# EAGLE design diode_sampling_gate_xformer (EAGLE 9.2.2)
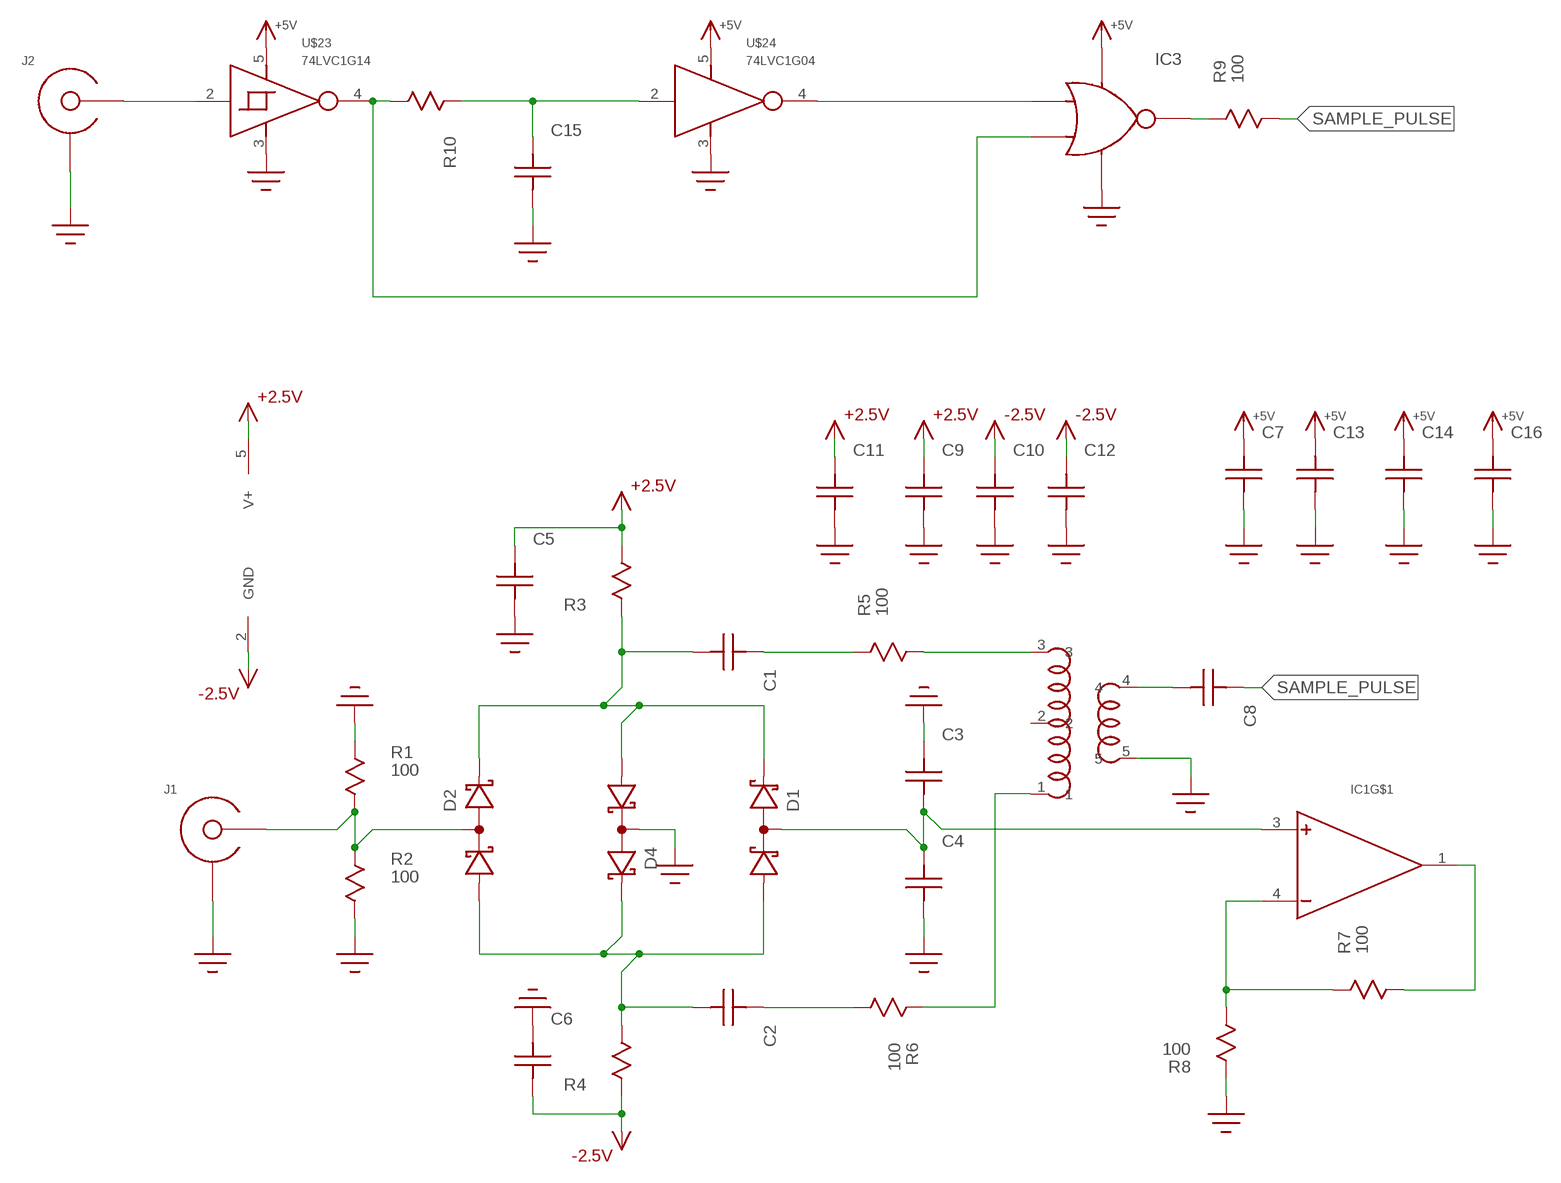
[diagram p0: schematic, sheet 1]

## Parts
C1  C0603  [C0603]
C2  C0603  [C0603]
C3  C0603  [C0603]
C4  C0603  [C0603]
C5  C0603  [C0603]
C6  C0603  [C0603]
C7  C0603  [C0603]
C8  C0603  [C0603]
C9  C0603  [C0603]
C10  C0603  [C0603]
C11  C0805  [0805]
C12  C0805  [0805]
C13  C0603  [C0603]
C14  C0603  [C0603]
C15  C0603  [C0603]
C16  C0805  [0805]
D1  BAS40-04  [SOT-23]
D2  BAS40-04  [SOT-23]
D4  BAS40-04  [SOT-23]
IC1  MCP6V81  [SOT23-5]
IC3  74LVC1G02  [SOT23-5]
J1  EDGE_LAUNCH_JACK  [EDGE_LAUNCH_RF_CON]
J2  EDGE_LAUNCH_JACK  [EDGE_LAUNCH_RF_CON]
R1  100  R0603  [R0603]
R2  100  R0603  [R0603]
R3  R0603  [R0603]
R4  R0603  [R0603]
R5  100  R0603  [R0603]
R6  100  R0603  [R0603]
R7  100  R0603  [R0603]
R8  100  R0603  [R0603]
R9  100  R0603  [R0603]
R10  R0603  [R0603]
T1  MABAES0061  [MABAES0061]
U$23  74LVC1G14  [SOT23-5]
U$24  74LVC1G04  [SOT23-5]

## Nets
+2.5V: C5.P$2 C9.P$2 C11.P$2 IC1.5(V+) R3.P$2
+5V: C7.P$2 C13.P$2 C14.P$2 C16.P$2 IC3.5(VCC) U$23.5(VCC) U$24.5(VCC)
-2.5V: C6.P$1 C10.P$2 C12.P$2 IC1.2(GND) R4.P$1
GND: C3.P$2 C4.P$1 C5.P$1 C6.P$2 C7.P$1 C9.P$1 C10.P$1 C11.P$1 C12.P$1 C13.P$1 C14.P$1 C15.P$1 C16.P$1 D4.3(COMMON) IC3.3(GND) J1.GND@1(SHIELD) J1.GND@2(SHIELD) J1.GND@3(SHIELD) J1.GND@4(SHIELD) J1.GND@5(SHIELD) J1.GND@6(SHIELD) J1.GND@7(SHIELD) J1.GND@8(SHIELD) J1.GND@9(SHIELD) J1.GND@10(SHIELD) J1.GND@11(SHIELD) J1.GND@12(SHIELD) J1.SHIELD@1(SHIELD) J1.SHIELD@2(SHIELD) J2.GND@1(SHIELD) J2.GND@2(SHIELD) J2.GND@3(SHIELD) J2.GND@4(SHIELD) J2.GND@5(SHIELD) J2.GND@6(SHIELD) J2.GND@7(SHIELD) J2.GND@8(SHIELD) J2.GND@9(SHIELD) J2.GND@10(SHIELD) J2.GND@11(SHIELD) J2.GND@12(SHIELD) J2.SHIELD@1(SHIELD) J2.SHIELD@2(SHIELD) R1.P$1 R2.P$2 R8.P$1 T1.5 U$23.3(GND) U$24.3(GND)
N$1: D2.3(COMMON) J1.CENTER R1.P$2 R2.P$1
N$2: C1.P$2 R5.P$1
N$3: C1.P$1 D1.2(CATHODE) D2.2(CATHODE) D4.1(ANODE) R3.P$1
N$4: IC3.2(B) R10.P$2 U$23.4(OUT)
N$5: C2.P$1 D1.1(ANODE) D2.1(ANODE) D4.2(CATHODE) R4.P$2
N$6: IC1.4(-) R7.P$1 R8.P$2
N$7: IC1.1(OUT) R7.P$2
N$8: IC3.1(A) U$24.4(OUT)
N$9: C2.P$2 R6.P$2
N$10: C3.P$1 C4.P$2 D1.3(COMMON) IC1.3(+)
N$11: R5.P$2 T1.3
N$12: R6.P$1 T1.1
N$13: C8.P$1 T1.4
N$14: C15.P$2 R10.P$1 U$24.2(IN)
N$15: IC3.4(Y) R9.P$1
N$16: J2.CENTER U$23.2(IN)
SAMPLE_PULSE: C8.P$2 R9.P$2
Unconnected: T1.2

## Library data of the parts
C1-C16 = yapo:C
D1 D2 D4 = yapo:BAS40-04
IC1 = yapo:MCP6V81
IC3 = yapo:74LVC1G02
J1 J2 = yapo:EDGE_LAUNCH_JACK
R1-R10 = yapo:R
T1 = yapo:MABAES0061
U$23 = yapo:74LVC1G14
U$24 = yapo:74LVC1G04

## Board
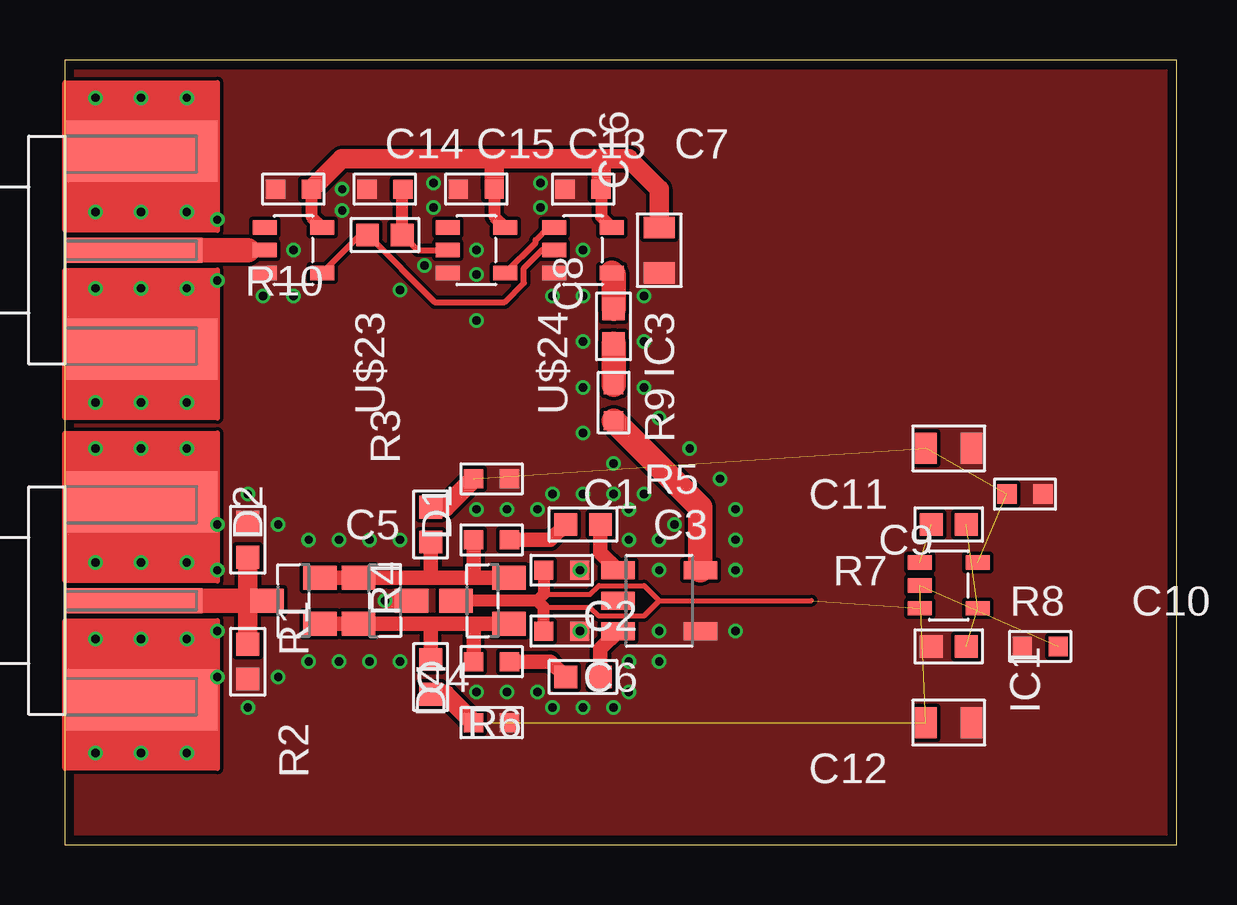
[diagram p1: board, top side]
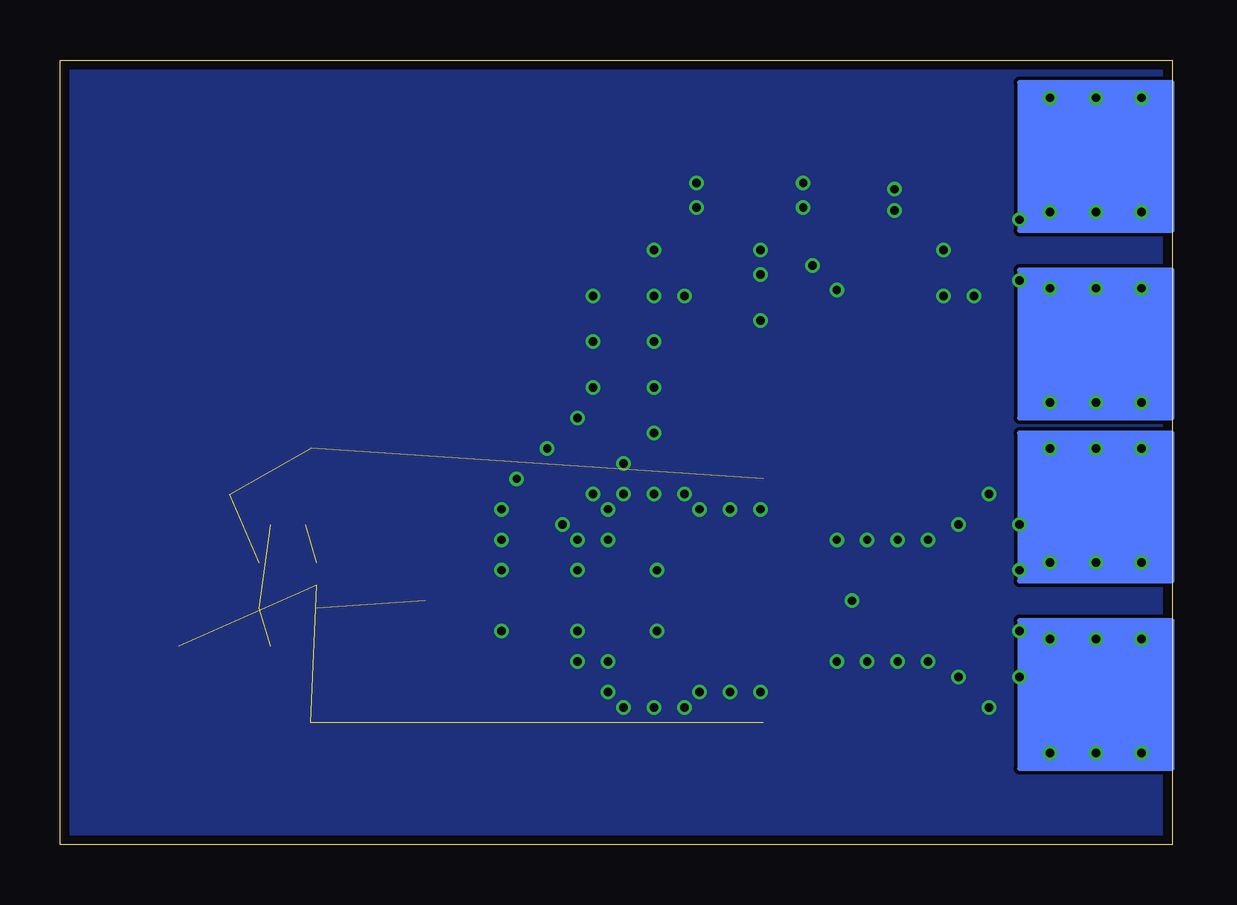
[diagram p2: board, bottom side, seen from below]

Size 46.34 x 32.69 mm. Coordinates in mm from the lower left corner, seen from the top.
Outline: 0,0 46.34,0 46.34,32.69 0,32.69 0,0
Copper layers (1*16): Top 0.035559375mm / dielectric 1.6mm / Bottom 0.035559375mm
Design rules "oshpark-2layer *": minimum track width 6mil, minimum drill 10mil, track to track 6mil, track to pad 6mil, pad to pad 6mil, via to via 6mil, smd to smd 6mil, copper to edge 15mil, drill to drill 6mil, minimum pad ring 5mil, minimum via ring 5mil, stop-mask expansion 2.5mil, vias tented up to drill 20mil, thermal gap 10mil

### Footprints (pad centres in the part's own frame; a part is rotated, then mirrored left to right if it is on the bottom)
C0603 = smd 0.8 x 0.8: P$1 -0.75,0; P$2 0.75,0
0805 = smd 0.9 x 1.3: P$1 -0.95,0; P$2 0.95,0
SOT-23 = smd 1 x 1.4: 1 -0.95,-1.1; 2 0.95,-1.1; 3 0,1.1
SOT23-5 = smd 0.6 x 1: 1 -0.95,-1.2; 2 0,-1.2; 3 0.95,-1.2; 4 0.95,1.2; 5 -0.95,1.2
EDGE_LAUNCH_RF_CON = smd 5.715 x 1.041: CENTER -2.875,0 | drill 0.35: GND@1 -5.08,1.587; GND@2 -3.175,1.587; GND@3 -1.27,1.587; GND@4 -5.08,-1.587; GND@5 -3.175,-1.587; GND@6 -1.27,-1.587; GND@7 -5.08,6.35; GND@8 -3.175,6.35; GND@9 -1.27,6.35; GND@10 -5.08,-6.35; GND@11 -3.175,-6.35; GND@12 -1.27,-6.35 | smd 6.35 x 2.54: SHIELD@1 -3.175,-4.128; SHIELD@2 -3.175,4.128
R0603 = smd 0.95 x 0.95: P$1 -0.725,0; P$2 0.725,0
MABAES0061 = smd 0.76 x 1.4: 1 1.27,-1.715; 2 0,-1.715; 3 -1.27,-1.715; 4 -1.27,1.715; 5 1.27,1.715

### Placement (x,y rotation side)
C1  17.78,12.7 0 top
C2  17.78,7.62 0 top
C3  20.7,11.43 0 top
C4  20.7,8.89 180 top
C5  17.78,15.24 180 top
C6  17.78,5.08 0 top
C7  21.59,27.3 0 top
C8  22.86,18.41 90 top
C9  40.01,14.61 180 top
C10  40.64,8.26 0 top
C11  36.83,16.51 180 top
C12  36.83,5.08 180 top
C13  17.14,27.3 0 top
C14  9.53,27.3 0 top
C15  13.34,27.3 0 top
C16  24.77,24.77 90 top
D1  17.4,10.16 90 top
D2  9.53,10.16 90 top
D4  13.34,10.16 270 top
IC1  36.83,10.79 270 top
IC3  21.59,24.77 270 top
J1  0,10.16 180 top
J2  0,24.77 180 top
R1  7.62,12.7 270 top
R2  7.62,7.62 270 top
R3  15.24,13.34 90 top
R4  15.24,6.99 90 top
R5  21.59,13.34 0 top
R6  21.59,6.99 180 top
R7  36.83,13.34 180 top
R8  36.83,8.26 0 top
R9  22.86,21.59 270 top
R10  13.34,25.4 180 top
T1  24.77,10.16 270 top
U$23  9.53,24.77 270 top
U$24  17.14,24.77 270 top

### Tracks (layer width: path | path; a pad name or v marks a point on that pad's centre or on a via)
+2.5V  (3 unrouted)
  Top 0.813: C5.P$2 15.85,14.06 R3.P$2
+5V
  Top 0.508: C14.P$2 10.28,26.16 U$23.5 | C13.P$2 17.89,26.16 U$24.5 | C7.P$2 22.34,26.16 IC3.5
  Top 0.813: C14.P$2 11.54,28.57 17.78,28.57 | 17.78,28.57 22.23,28.57 | 22.23,28.57 23.5,28.57 24.77,27.3 C16.P$2 | C7.P$2 22.34,28.46 22.23,28.57 | C13.P$2 17.89,28.46 17.78,28.57
-2.5V  (3 unrouted)
  Top 0.813: C6.P$1 15.85,6.26 R4.P$1
GND  (via drill 0.35)
  Top 0.61: D4.3 v13.34,10.16
  other vias: 7.62,14.61 7.62,5.71 6.35,8.89 6.35,11.43 6.35,13.34 8.89,13.34 8.89,6.99 6.35,6.99 21.46,11.43 21.46,8.89 10.16,12.7 11.43,12.7 12.7,12.7 13.97,12.7 10.16,7.62 11.43,7.62 12.7,7.62 13.97,7.62 17.14,6.35 18.41,6.35 19.68,6.35 17.14,13.97 18.41,13.97 19.68,13.97 20.32,14.61 21.59,14.61 22.86,14.61 20.32,5.71 21.59,5.71 22.86,5.71 23.5,6.35 23.5,7.62 23.5,13.97 23.5,12.7 24.77,12.7 24.77,7.62 25.4,13.34 22.86,15.88 24.13,14.61 21.59,17.14 21.59,19.05 21.59,20.95 21.59,22.86 24.13,19.05 24.77,17.78 26.04,16.51 27.3,15.24 27.94,13.97 27.94,12.7 27.94,11.43 24.77,11.43 24.13,20.95 24.13,22.86 27.94,8.89 24.77,8.89 11.56,27.3 15.37,27.56 19.81,27.56 17.14,24.77 9.53,24.77 21.59,24.77 20.32,22.86 17.14,23.75 14.99,24.13 9.53,22.86 8.26,22.86 6.35,23.5 6.35,26.04 15.37,26.54 19.81,26.54 11.56,26.42 17.14,21.84 13.97,23.11
  pour Bottom (no thermals): 0,0 46.35,0 46.35,33.02 0,33.02
  pour Top (no thermals): 0,0 46.35,0 46.35,33.02 0,33.02
N$1
  Top 0.813: R1.P$2 7.62,10.16 R2.P$1
  Top 1.016: J1.CENTER 7.62,10.16 D2.3
N$2
  Top 0.61: C1.P$2 20.23,12.7 R5.P$1
N$3
  Top 0.61: D2.2 D4.1 13.54,11.11 13.55,11.12 15.24,11.12 | D1.2 17.2,11.11 17.19,11.12 | 17.19,11.12 15.24,11.12 | R3.P$1 15.24,11.12 | C1.P$1 17.03,11.28 17.19,11.12
N$4
  Top 0.254: IC3.2 19.87,24.77 19.12,24.02 19.12,23.4 18.33,22.6 15.41,22.6 R10.P$2 12.31,25.4 U$23.4
N$5
  Top 0.61: D1.1 17.2,9.21 17.19,9.2 | 17.19,9.2 15.24,9.2 | 15.24,9.2 13.55,9.2 13.54,9.21 D4.2 D2.1 | R4.P$2 15.24,9.2 | C2.P$1 17.03,9.04 17.19,9.2
N$6  (2 unrouted)
N$7  (1 unrouted)
N$8
  Top 0.254: U$24.4 19.61,25.08 19.61,25.18 20.14,25.71 IC3.1
N$9
  Top 0.61: C2.P$2 20.23,7.62 R6.P$2
N$10  (1 unrouted)
  Top 0.203: 19.95,10.43 21.88,10.43 22.25,10.79 24.13,10.79 24.77,10.16 | 19.95,9.89 21.88,9.89 22.25,9.53 24.13,9.53 24.77,10.16 | 24.77,10.16 31.11,10.16
  Top 0.508: 19.68,10.16 D1.3 | C3.P$1 19.95,10.43 19.68,10.16 | C4.P$2 19.95,9.89 19.68,10.16
N$11
  Top 0.61: R5.P$2 22.32,12.16 T1.3
N$12
  Top 0.61: T1.1 22.32,8.15 R6.P$1
N$13
  Top 1.016: C8.P$1 26.48,14.04 T1.4
N$14
  Top 0.254: R10.P$1 14.7,24.77 U$24.2
  Top 0.508: R10.P$1 14.06,27.28 C15.P$2
N$15
  Top 1.016: IC3.4 22.86,23.75 R9.P$1
N$16
  Top 0.508: 7.62,24.77 U$23.2
  Top 1.016: J2.CENTER 7.62,24.77
SAMPLE_PULSE
  Top 1.016: R9.P$2 C8.P$2